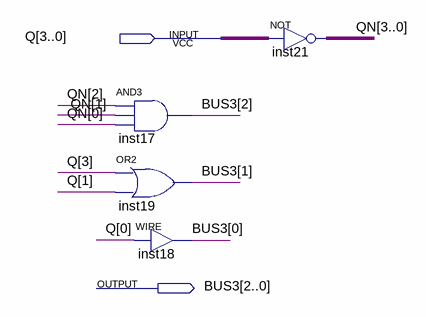
[diagram p0: schematic sheet]
// Quartus schematic BUS3.bdf as structural Verilog: 4 symbols, 2 pins
module BUS3 (
  input  [3:0] Q,
  output [2:0] BUS3
);

  wire [3:0] QN;

  and inst17 (BUS3[2], QN[2], QN[1], QN[0]);
  or inst19 (BUS3[1], Q[3], Q[1]);
  assign BUS3[0] = Q[0];  // WIRE inst18
  assign QN = ~Q;  // NOT inst21, 4 bits wide
endmodule
